# Altium project 定位.PrjPCB
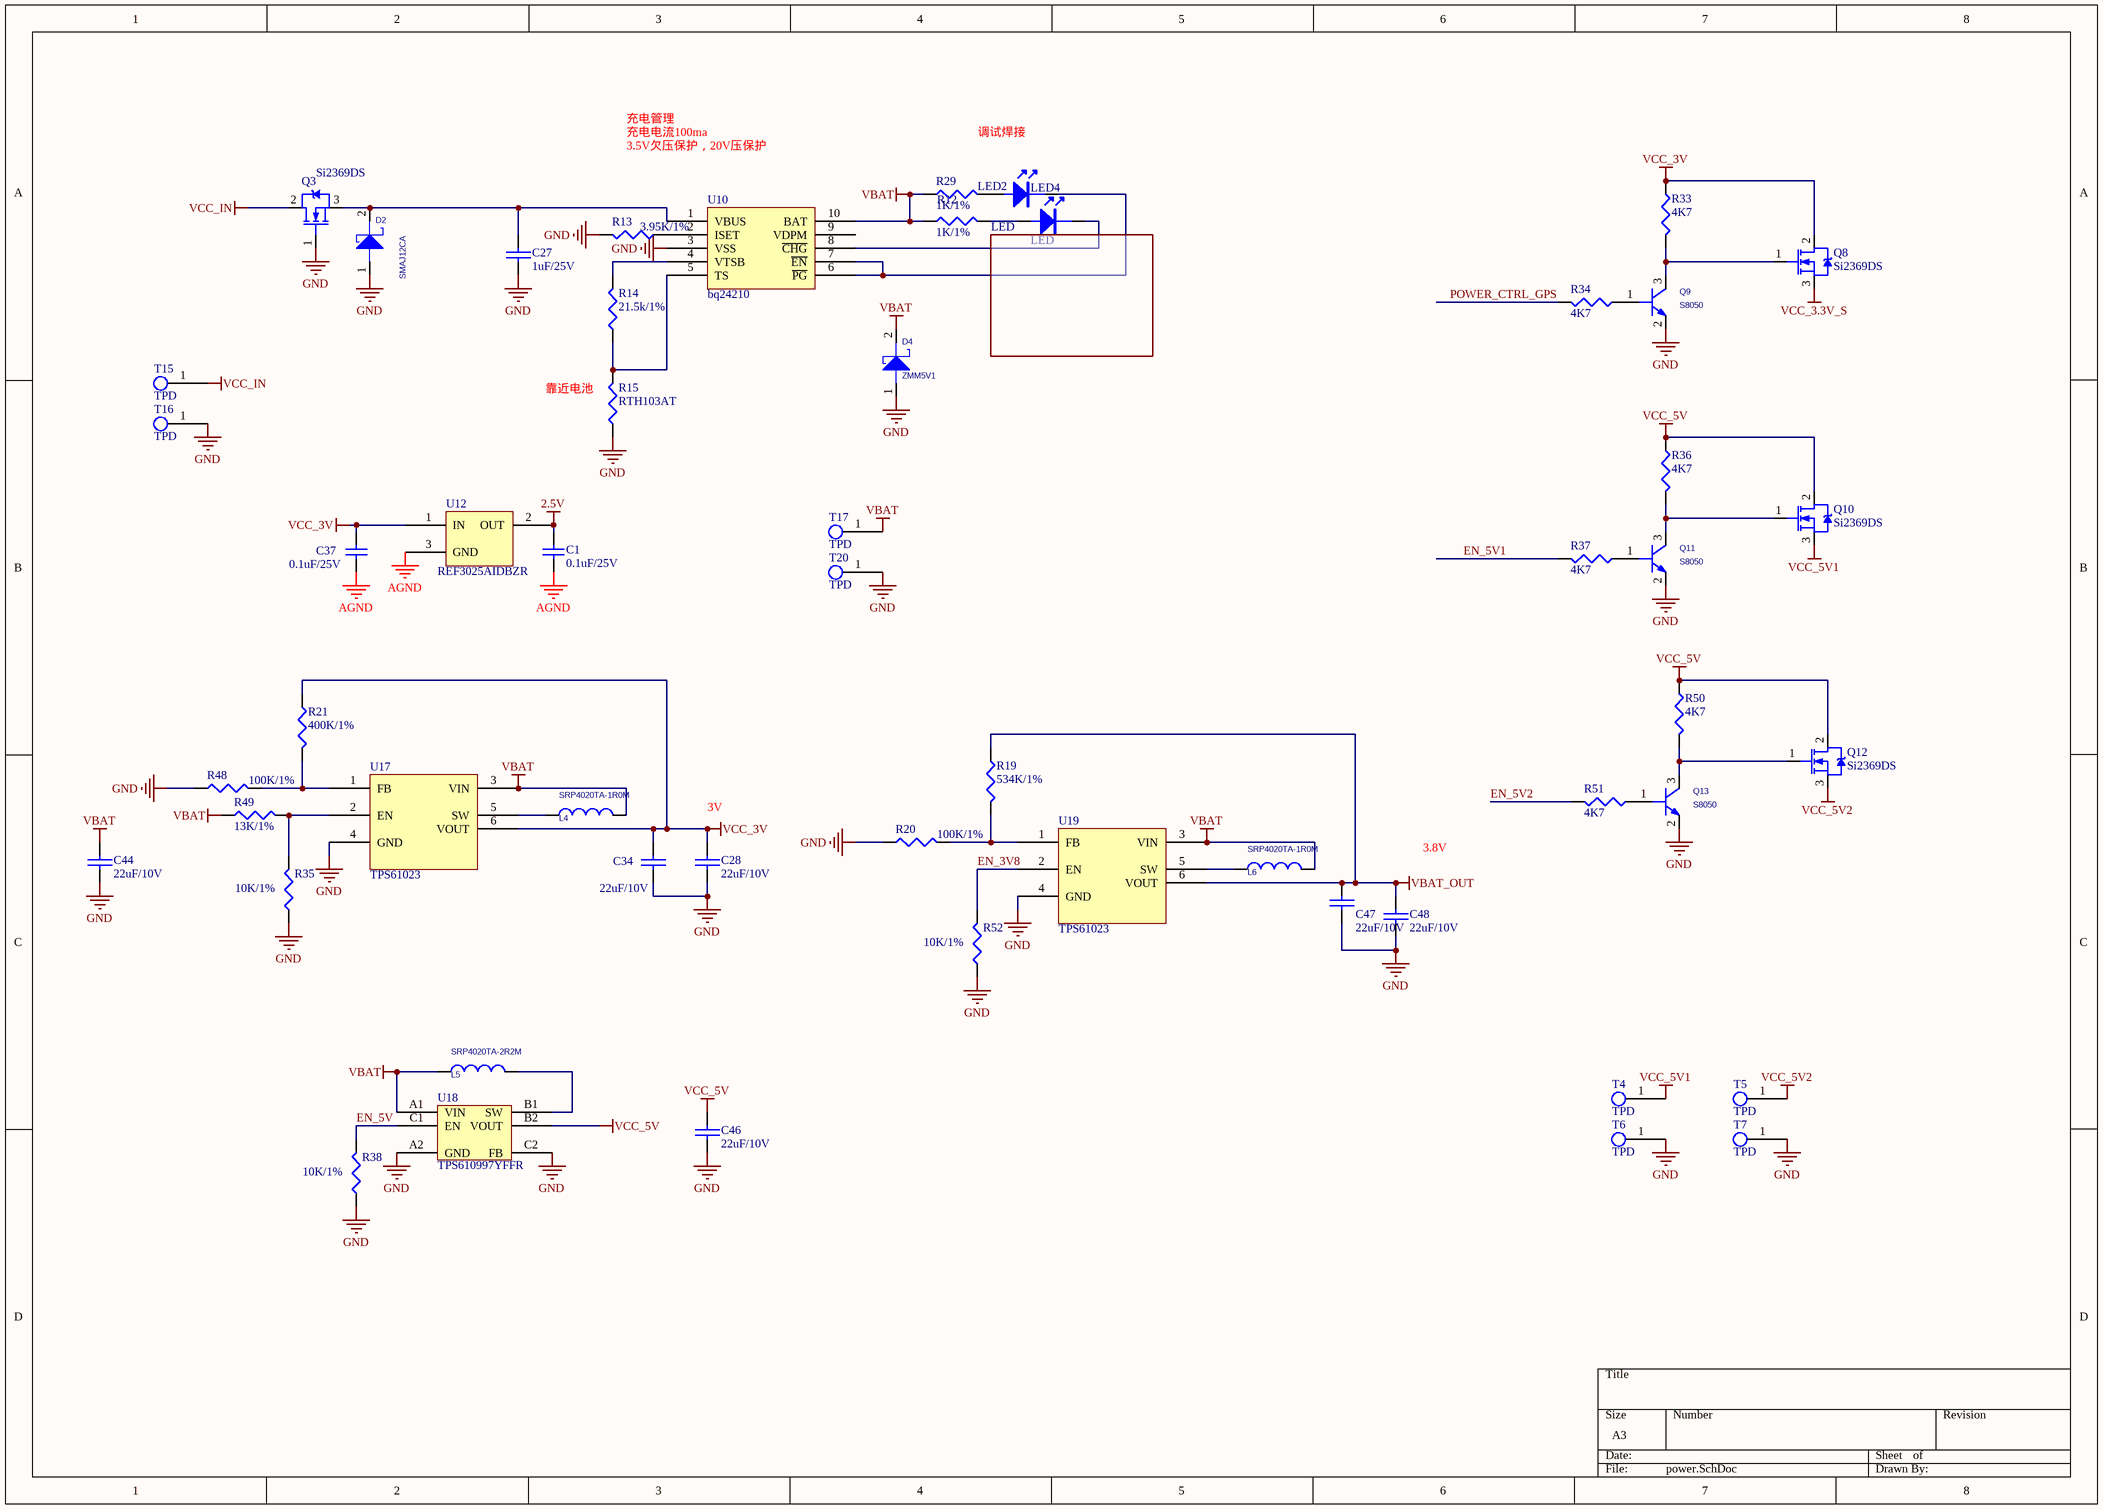
[diagram p0: power.SchDoc]
1 sheet, 55 parts. Net scope: global (net labels, ports and power ports of the same name join across sheets).
Board files: PCB1.2.PcbDoc, 拼版.PcbDoc

## Sheet power.SchDoc
size A3

### Parts
C1  0.1uF/25V  [0402c]
C27  1uF/25V  [0402C]
C28  22uF/10V  [0805C]
C34  22uF/10V  [0805C]
C37  0.1uF/25V  [0402c]
C44  22uF/10V  [0805C]
C46  22uF/10V  [0805C]
C47  22uF/10V  [0805C]
C48  22uF/10V  [0805C]
D2  SMAJ12CA  [SMA]
D4  value ZMM5V1  [LL-34(D1206)]  (hidden comment: DIODE_SCHOTTKY_0)
L4  SRP4020TA-1R0M  [L2520]
L5  SRP4020TA-2R2M  [L2520]
L6  SRP4020TA-1R0M  [L2520]
LED2  LED  [0603LED]
LED4  LED  [0603LED]
Q3  Si2369DS  [sot23-3]
Q8  Si2369DS  [sot23-3]
Q9  S8050  [SOT23-3]
Q10  Si2369DS  [sot23-3]
Q11  S8050  [SOT23-3]
Q12  Si2369DS  [sot23-3]
Q13  S8050  [SOT23-3]
R12  1K/1%  [0402R]
R13  3.95K/1%  [0402R]
R14  21.5k/1%  [0402R]
R15  RTH103AT  [0603R]
R19  534K/1%  [0402R]
R20  100K/1%  [0402R]
R21  400K/1%  [0402R]
R29  1K/1%  [0402R]
R33  4K7  [0402R]
R34  4K7  [0402R]
R35  10K/1%  [0402R]
R36  4K7  [0402R]
R37  4K7  [0402R]
R38  10K/1%  [0402R]
R48  100K/1%  [0402R]
R49  13K/1%  [0402R]
R50  4K7  [0402R]
R51  4K7  [0402R]
R52  10K/1%  [0402R]
T4  TPD  [TP]
T5  TPD  [TP]
T6  TPD  [TP]
T7  TPD  [TP]
T15  TPD  [TP]
T16  TPD  [TP]
T17  TPD  [TP]
T20  TPD  [TP]
U10  bq24210  [QFN50P200X300X80-10N]
U12  REF3025AIDBZR  [SOT23-3]
U17  TPS61023  [SOT563-6]
U18  TPS610997YFFR  [TPS610997YFFR]
U19  TPS61023  [SOT563-6]

### Nets
2.5V: C1.1 U12.2(OUT)
AGND: C1.2 C37.2 U12.3(GND)
GND: C27.2 C28.2 C34.2 C44.2 C46.2 C47.2 C48.2 D2.1 D4.1 Q3.1(G) Q9.2(E) Q11.2(E) Q13.2(E) R13.2 R15.1 R20.1 R35.1 R38.1 R48.1 R52.1 T6.1 T7.1 T16.1 T20.1 U10.3(VSS) U17.4(GND) U18.A2(GND) U18.C2(FB) U19.4(GND)
VBAT: C44.1 D4.2 L4.2 L5.1 L6.2 R12.1 R29.1 R49.1 T17.1 U10.10(BAT) U17.3(VIN) U18.A1(VIN) U19.3(VIN)
VBAT_OUT: C47.1 C48.1 R19.1 U19.6(VOUT)
VCC_3.3V_S: Q8.3(S)
VCC_3V: C28.1 C34.1 C37.1 Q8.2(D) R21.1 R33.1 U12.1(IN) U17.6(VOUT)
VCC_5V: C46.1 Q10.2(D) Q12.2(D) R36.1 R50.1 U18.B2(VOUT)
VCC_5V1: Q10.3(S) T4.1
VCC_5V2: Q12.3(S) T5.1
VCC_IN: Q3.2(D) T15.1
EN_3V8: R52.2 U19.2(EN)
EN_5V: R38.2 U18.C1(EN)
EN_5V1: R37.2
EN_5V2: R51.2
POWER_CTRL_GPS: R34.2
NetC27_1: C27.1 D2.2 Q3.3(S) U10.1(VBUS)
NetL4_1: L4.1 U17.5(SW)
NetL5_2: L5.2 U18.B1(SW)
NetL6_1: L6.1 U19.5(SW)
NetLED2_1: LED2.1 R29.2
NetLED2_2: LED2.2 U10.6(~{PG}) U10.7(~{EN})
NetLED4_1: LED4.1 R12.2
NetLED4_2: LED4.2 U10.8(~{CHG})
NetQ8_1: Q8.1(G) Q9.3(C) R33.2
NetQ9_1: Q9.1(B) R34.1
NetQ10_1: Q10.1(G) Q11.3(C) R36.2
NetQ11_1: Q11.1(B) R37.1
NetQ12_1: Q12.1(G) Q13.3(C) R50.2
NetQ13_1: Q13.1(B) R51.1
NetR13_1: R13.1 U10.2(ISET)
NetR14_1: R14.1 R15.2 U10.5(TS)
NetR14_2: R14.2 U10.4(VTSB)
NetR19_2: R19.2 R20.2 U19.1(FB)
NetR21_2: R21.2 R48.2 U17.1(FB)
NetR35_2: R35.2 R49.2 U17.2(EN)

Not connected (* = marked no-connect by the designer): U10 9(VDPM)

### Notes on the sheet
- 充电管理
- 充电电流100ma
- 3.5V欠压保护，20V压保护
- 调试焊接
- (near R15) 靠近电池
- (near C28) 3V
- 3.8V

### Library data of the parts
C1 C37 = Cap: Capacitor; Value: 0.1uF; Published: 8-Jun-2000; LatestRevisionDate: 17-Jul-2002; LatestRevisionNote: Re-released for DXP Platform.; PackageReference: RAD-0.3; Publisher: Altium Limited; PackageDescription: Radial Cap, Thru-Hole; 2 Leads; 0.3 in Pin Spacing
C27 C28 C34 C44 C46-C48 = CAP: Capacitor
D2 D4 = DIODE_SCHOTTKY_0: PCB DECAL: DO_214AC; Source_Path: E:\AIH\WORK\A\LIBRARY1.OLB
  D2: Value: SMAJ12CA
L4-L6 = INDUCTOR_1
Q3 Q8 Q10 Q12 = NCE4060K: NMOSFET
Q9 Q11 Q13 = 2N1069_1: PspiceTemplate: Q^@REFDES %C %B %E
R12-R15 R19-R21 R29 R33-R38 R48-R52 = RES1: P: 1/8W
U10 = bq2410
U12 = REF3012